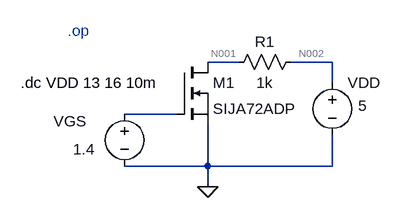
[diagram p0: schematic mosfet.asc]
mosfet.asc, the LTspice schematic file:
Version 4.1
SHEET 1 880 680
WIRE 272 80 224 80
WIRE 416 80 352 80
WIRE 416 112 416 80
WIRE 176 160 96 160
WIRE 224 240 224 176
WIRE 224 240 96 240
WIRE 416 240 416 192
WIRE 416 240 224 240
WIRE 224 272 224 240
FLAG 224 272 0
SYMBOL nmos 176 80 R0
SYMATTR InstName M1
SYMATTR Value SIJA72ADP
SYMBOL voltage 96 144 R0
WINDOW 0 -109 27 Left 2
WINDOW 3 -79 70 Left 2
WINDOW 123 0 0 Left 0
WINDOW 39 0 0 Left 0
SYMATTR InstName VGS
SYMATTR Value 1.4
SYMBOL voltage 416 96 R0
WINDOW 123 0 0 Left 0
WINDOW 39 0 0 Left 0
WINDOW 3 40 51 Left 2
SYMATTR Value 5
SYMATTR InstName VDD
SYMBOL res 368 64 R90
WINDOW 0 0 56 VBottom 2
WINDOW 3 32 56 VTop 2
SYMATTR InstName R1
SYMATTR Value 1k
TEXT -64 112 Left 2 !.dc VDD 13 16 10m
TEXT 8 32 Left 2 ;.op

The netlist it stands for:
* mosfet.asc
M1 N001 N003 0 0 SIJA72ADP
VGS N003 0 1.4
VDD N002 0 5
R1 N002 N001 1k
.model NMOS NMOS
.model PMOS PMOS
.lib standard.mos
.dc VDD 13 16 10m
* .op
.backanno
.end

* Results of the author's LTspice run, read from the files saved beside the schematic
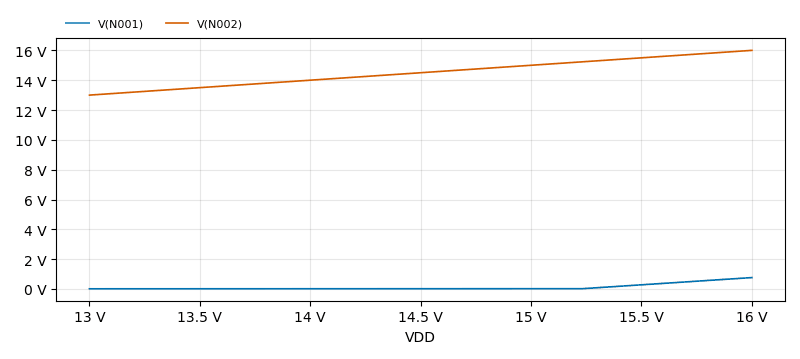
[diagram p1: DC transfer characteristic of mosfet.asc, plotted from the saved traces]
* DC transfer characteristic, 1 run:
*   V(N001): 12.35 mV at VDD=13 V, 764.5 mV at VDD=16 V, min 12.35 mV, max 764.5 mV
*   V(N002): 13 V at VDD=13 V, 16 V at VDD=16 V, min 13 V, max 16 V